# Altium schematic sheet Fri3D_IRA_Peripherals.SchDoc: Peripherals
size A3; Date: 26/12/2021; DrawnBy: Wim Van Gool; DocumentNumber: 3; Revision: 01; SheetNumber: 3; SheetTotal: 4
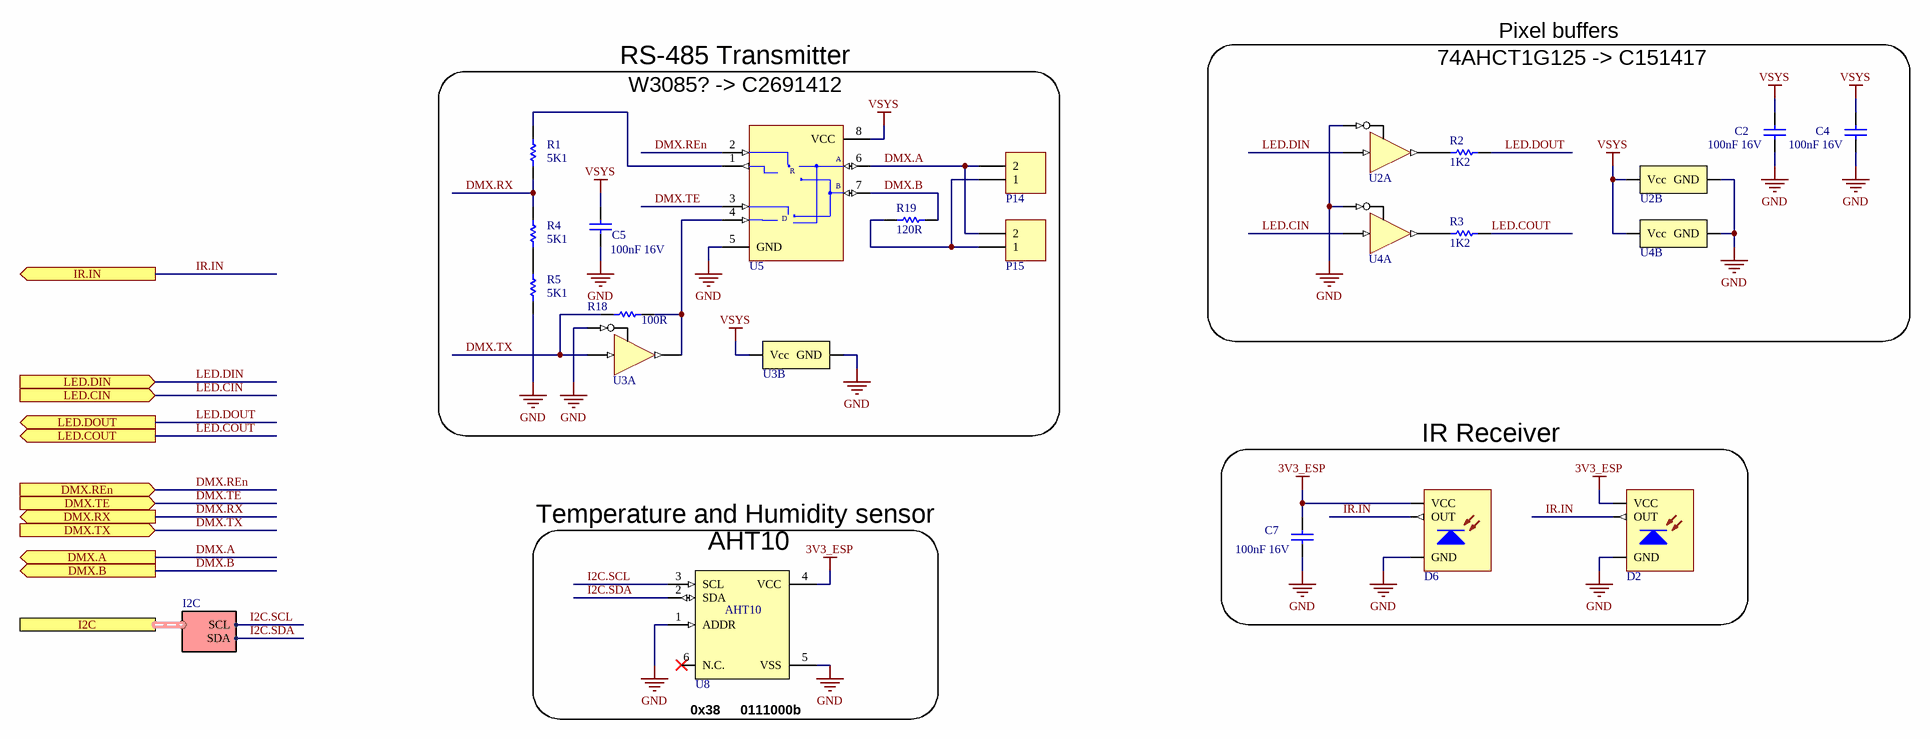
[diagram p0: Fri3D_IRA_Peripherals.SchDoc]

## Parts
C2  value 100nF 16V  [C0603_N]
C4  value 100nF 16V  [C0603_N]
C5  value 100nF 16V  [C0603_N]
C7  value 100nF 16V  [C0603_N]
D2  ZIRM-5042B-42-Z2 Infrared Receiver 38 kHz 45° 2.7-5.5V 940nm  [CHAU_ZIRM-5042B-42-Z2]  (value not drawn)
D6  IRM-3638N3F14 Infrared Receiver 38 kHz 45° 2.7-5.5V  [VIS_TSOP381x_BENT]  (value not drawn)
P14  Easy to solder connection  [SOLDER_SW_V_1MM]  (value not drawn)
P15  Header 2  [HDR1X2]  (value not drawn)
R1  value 5K1  [R0603_N]  (hidden comment: RESISTOR)
R2  value 1K2  [R0603_N]  (hidden comment: RESISTOR)
R3  value 1K2  [R0603_N]  (hidden comment: RESISTOR)
R4  value 5K1  [R0603_N]  (hidden comment: RESISTOR)
R5  value 5K1  [R0603_N]  (hidden comment: RESISTOR)
R18  value 100R  [R0603_N]  (hidden comment: RESISTOR)
R19  value 120R  [R1206]  (hidden comment: RESISTOR)
U2  SN74AHCT1G125DCKR  Buffer, Tri-State, 4.5V to 5.5V  [TI_DCK_R-PDSO-G5]  (value not drawn)  (parts A,B of 2)
U3  SN74AHCT1G125DCKR  Buffer, Tri-State, 4.5V to 5.5V  [TI_DCK_R-PDSO-G5]  (value not drawn)  (parts A,B of 2)
U4  SN74AHCT1G125DCKR  Buffer, Tri-State, 4.5V to 5.5V  [TI_DCK_R-PDSO-G5]  (value not drawn)  (parts A,B of 2)
U5  RS-485 5V Transceiver  [SOIC_N_8]  (value not drawn)
U8  AHT 10 Temperature and humidity sensor  [AHT10]  (value not drawn)

## Blocks framed on the sheet
RS-485 Transmitter: C5 P14 P15 R1 R4 R5 R18 R19 U3 U5
IR Receiver: C7 D2 D6

## Ports
DMX.A (out), DMX.B (out), DMX.REn (in), DMX.RX (out), DMX.TE (in), DMX.TX (in), I2C (harness I2C), IR.IN (out), LED.CIN (in), LED.COUT (out), LED.DIN (in), LED.DOUT (out)

## Harnesses
I2C: SDA, SCL

## Nets
3V3_ESP: C7.1 D2.3(VCC) D6.3(VCC) U8.4(VCC)
GND: C2.2 C4.2 C5.2 C7.2 D2.2(GND) D6.2(GND) R5.2 U2.1(~{OE}) U2.3(GND) U3.1(~{OE}) U3.3(GND) U4.1(~{OE}) U4.3(GND) U5.5(GND) U8.1(ADDR) U8.5(VSS)
VSYS: C2.1 C4.1 C5.1 U2.5(Vcc) U3.5(Vcc) U4.5(Vcc) U5.8(VCC)
DMX.A: P14.2 P15.2 U5.6(A) ; port DMX.A
DMX.B: R19.2 U5.7(B) ; port DMX.B
DMX.REn: U5.2(~{RE}) ; port DMX.REn
DMX.RX: R1.2 R4.1 ; port DMX.RX
DMX.TE: U5.3(DE) ; port DMX.TE
DMX.TX: R18.1 U3.2(A) ; port DMX.TX
I2C.SCL: U8.3(SCL) ; port I2C.SCL
I2C.SDA: U8.2(SDA) ; port I2C.SDA
IR.IN: D2.1(OUT) D6.1(OUT) ; port IR.IN
LED.CIN: U4.2(A) ; port LED.CIN
LED.COUT: R3.2 ; port LED.COUT
LED.DIN: U2.2(A) ; port LED.DIN
LED.DOUT: R2.2 ; port LED.DOUT
NetP14_1: P14.1 P15.1 R19.1
NetR1_1: R1.1 U5.1(RO)
NetR2_1: R2.1 U2.4(Y)
NetR3_1: R3.1 U4.4(Y)
NetR4_2: R4.2 R5.1
NetR18_2: R18.2 U3.4(Y) U5.4(DI)

Not connected (* = marked no-connect by the designer): U8 6(N.C.)*

## Notes on the sheet
- Pixel buffers
- (near U5) W3085? -> C2691412
- 74AHCT1G125 -> C151417
- Temperature and Humidity sensor
- (near U8) AHT10
- (near U8) 0x38
- (near U8) 0111000b
- Title
- Revision
- Date
- Dranw By
- Size
- A3
- Sheet
- of
- (in symbol MAX485 # RS-485 transceiver) R; D

## Library data of the parts
C2 C4 C5 C7 = CAP # 100nF 16V 0603: Capacitor Ceramic
D2 = PHO IR Rx 940nm ZIRM-5042B-42-Z2: =Description; Value: ZIRM-5042B-42-Z2; Supplier 1: LCSC; Supplier Part Number 1: C575386
D6 = PHO IR Rx RA: =Description; Value: IRM-3638N3F14; Supplier 1: LCSC; Supplier Part Number 1: C264262
P14 = SOLDER SW V 1MM: Value: NO BOM
P15 = Pin Header 2.54mm 2way
R1 R4 R5 = RES # 5K1 0603: Supplier 1: Farnell; Supplier Part Number 1: 2845922
R2 R3 = RES # 1K2 0603
R18 = RES # 100R 0603
R19 = RES # 120R 1206: Supplier 3: Generic; Supplier Part Number 3: 120R 1% 1206
U2-U4 = BUF # 1 SN74AHCT1G125DCKR: =Description; Value: SN74AHCT1G125DCKR; Supplier 1: LCSC; Supplier Part Number 1: C151417; Supplier 2: LCSC; Supplier Part Number 2: C350557
U5 = MAX485 # RS-485 transceiver: Value: MAX485ECSA+; Supplier 1: Farnell; Supplier Part Number 1: 9724524
U8 = TMP HUM # AHT10: =Description; Value: AHT10; Supplier 1: LCSC; Supplier Part Number 1: C368909